# EAGLE design ESP8266-DS18B20-lite (EAGLE 7.6.0)
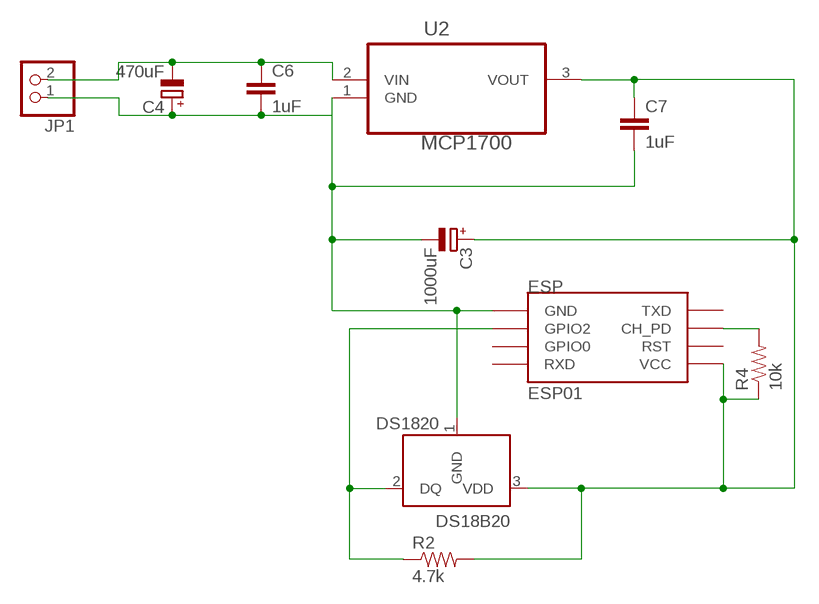
[diagram p0: schematic, sheet 1]

## Parts
C3  1000uF  CPOL-EUE2.5-5  [E2,5-5]
C4  470uF  CPOL-EUE2.5-5  [E2,5-5]
C6  1uF  CAPEZ  [CAP-PTH-SMALLEZ]
C7  1uF  CAPEZ  [CAP-PTH-SMALLEZ]
DS18B20  DS1820  [TO-92]
ESP  ESP01  [ESP01]
JP1  PINHD-1X2/90  [1X02/90]
R2  4.7k  RESISTORAXIAL-0.3  [AXIAL-0.3]
R4  10k  RESISTORAXIAL-0.3  [AXIAL-0.3]
U2  MCP1700  MCP1700-3302E/TO  [TO127P254X495-3]

## Nets
3V3: C3.+ C7.1 DS18B20.3(VDD) ESP.VCC R2.P$2 R4.P$1 U2.3(VOUT)
6.2V: C4.- C6.1 JP1.2 U2.2(VIN)
CH: ESP.CH_PD R4.P$2
DQ: DS18B20.2(DQ) ESP.GPIO2 R2.P$1
GND: C3.- C4.+ C6.2 C7.2 DS18B20.1(GND) ESP.GND JP1.1 U2.1(GND)
Unconnected: ESP.GPIO0 ESP.RST ESP.RX(RXD) ESP.TX(TXD)

## Library data of the parts
C3 C4 = rcl:CPOL-EU: POLARIZED CAPACITOR, European symbol
C6 C7 = SparkFun-Capacitors:CAP: Capacitor Standard 0603 ceramic capacitor, and 0.1" leaded capacitor.
DS18B20 = DS1820:DS1820: DS1820 - 1-Wire Digital Thermometer
ESP = esp8266modules:ESP01: ESP8266 Wifi module 01
JP1 = pinhead:PINHD-1X2: PIN HEADER
R2 R4 = SparkFun-Passives:RESISTOR: Resistor Basic schematic elements and footprints for 0603, 1206, and PTH resistors.
U2 = mcp1700:MCP1700-3302E/TO: IC, Low Quiescent Current LDO,3.3V,TO-92; MPN: MCP1700-3302E/TO; OC_FARNELL: 1296588; OC_NEWARK: 88H9804; PACKAGE: TO-92; SUPPLIER: Microchip

## Board
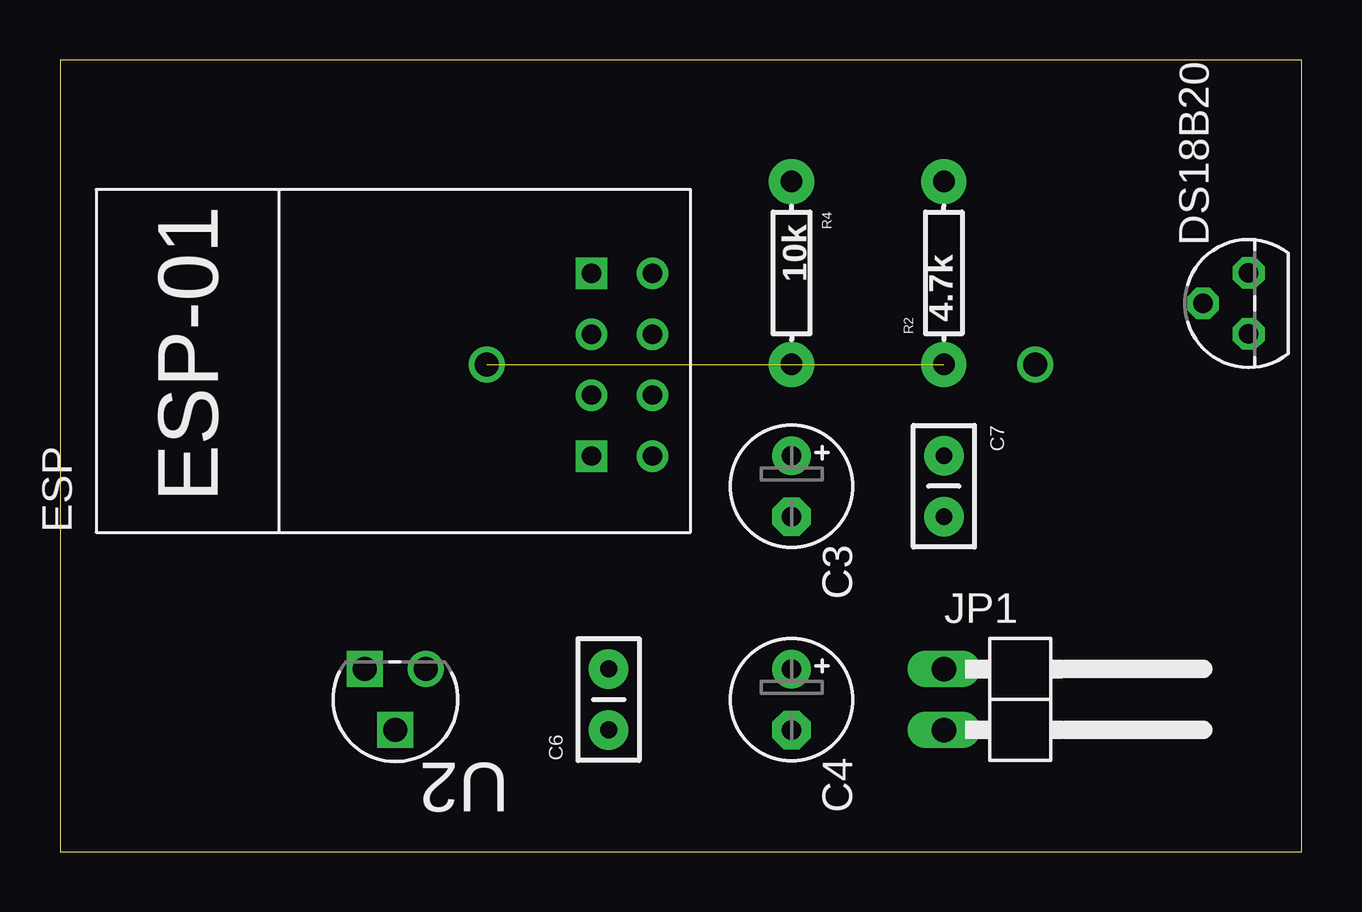
[diagram p1: board, top side]
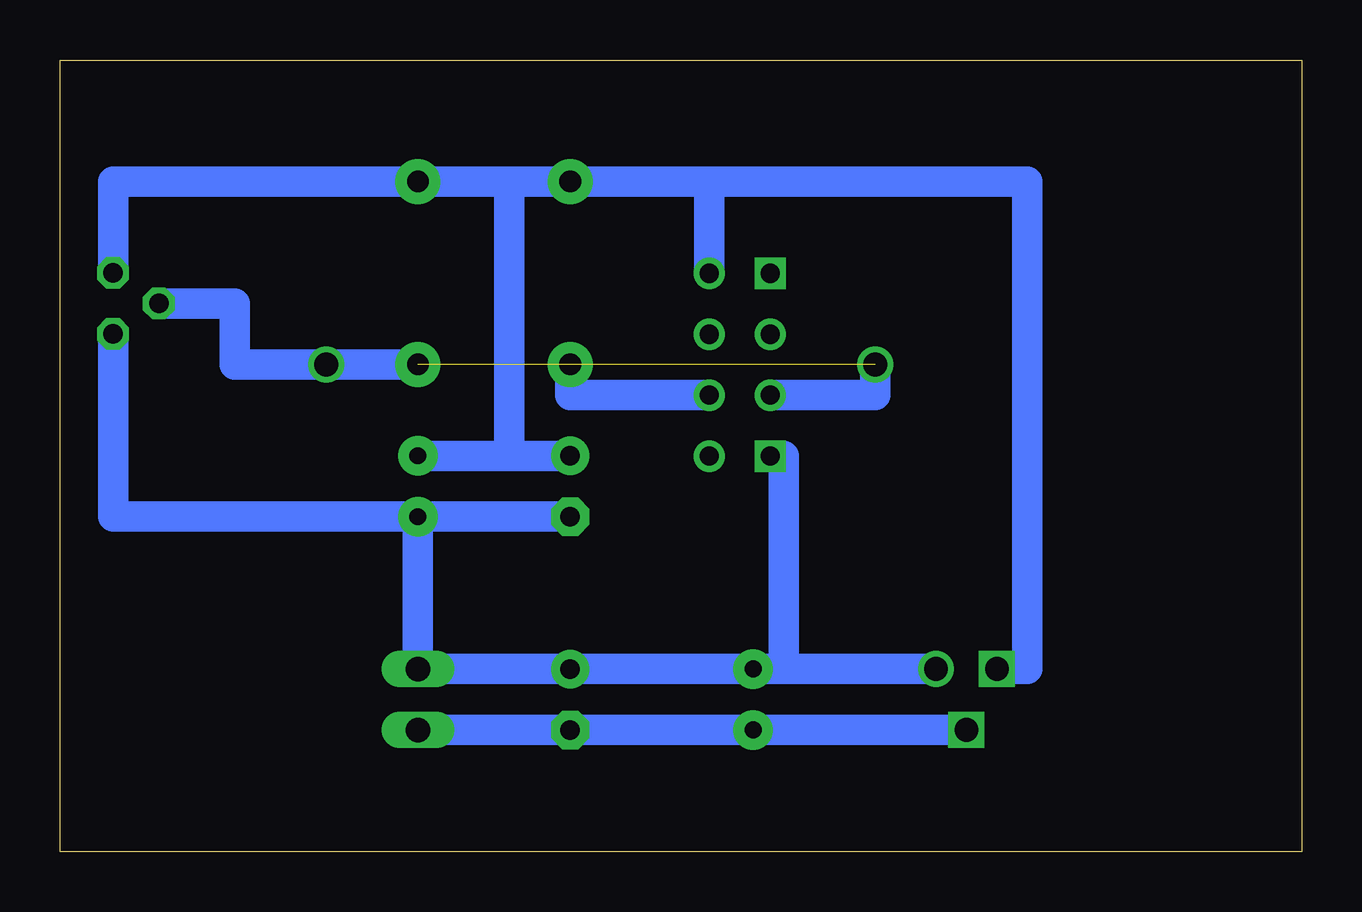
[diagram p2: board, bottom side, seen from below]

Size 51.74 x 33.01 mm. Coordinates in mm from the lower left corner, seen from the top.
Outline: 0,0 51.74,0 51.74,33.01 0,33.01 0,0
Copper layers (1*16): Top 0.035mm / dielectric 1.5mm / Bottom 0.035mm
Design rules "default": minimum track width 10mil, minimum drill 24mil, track to track 8mil, track to pad 8mil, pad to pad 8mil, via to via 8mil, smd to smd 8mil, copper to edge 40mil, drill to drill 8mil, minimum pad ring 10mil, minimum via ring 8mil, stop-mask expansion 4mil, vias tented up to drill 0mil, thermal gap 10mil

### Footprints (pad centres in the part's own frame; a part is rotated, then mirrored left to right if it is on the bottom)
E2,5-5 = drill 0.813 pad 1.6: + -1.27,0 | drill 0.813 pad 1.6 octagon: - 1.27,0
CAP-PTH-SMALLEZ = drill 0.7 pad 1.651: 1 0,0; 2 2.54,0
TO-92 = drill 0.813 pad 1.27 octagon: 1 -1.27,0; 2 0,1.905; 3 1.27,0
ESP01 = drill 0.8: CH_PD -1.285,-8.178; GPIO0 1.255,-5.638; GPIO2 -1.285,-5.638; RST 1.255,-8.178; TX -3.825,-8.178; VCC 3.795,-8.178 | drill 0.8 square: GND -3.825,-5.638; RX 3.795,-5.638
1X02/90 = drill 1.016 long: 1 -1.27,-3.81; 2 1.27,-3.81
AXIAL-0.3 = drill 0.9 pad 1.88: P$1 -3.81,0; P$2 3.81,0
TO127P254X495-3 = drill 0.991: 1 -2.54,-2.54 | drill 0.991 square: 2 -1.27,0; 3 0,-2.54

### Placement (x,y rotation side)
C3  30.48,15.24 270 top
C4  30.48,6.35 270 top
C6  22.86,5.08 90 top
C7  36.83,16.51 270 top
DS18B20  49.53,22.86 90 top
ESP  16.51,20.32 90 top
JP1  40.64,6.35 270 top
R2  36.83,24.13 90 top
R4  30.48,24.13 270 top
U2  12.7,5.08 180 top

### Tracks (layer width: path | path; a pad name or v marks a point on that pad's centre or on a via)
3V3
  Bottom 1.27: DS18B20.3 49.53,27.94 R2.P$2 33.02,27.94 | C7.1 C3.+ 33.02,16.51 33.02,27.94 | 33.02,27.94 R4.P$1 24.69,27.94 | 24.69,27.94 ESP.VCC | U2.3 11.43,7.62 11.43,27.94 24.69,27.94
6.2V
  Bottom 1.27: U2.2 C6.1 C4.- JP1.2
CH
  Bottom 1.27: R4.P$2 30.48,19.05 ESP.CH_PD
DQ  (via drill 1)  (1 unrouted)
  Bottom 1.27: DS18B20.2 44.45,22.86 44.45,20.32 v40.64,20.32 R2.P$1 | ESP.GPIO2 17.78,19.03 v17.78,20.32
GND
  Bottom 1.27: ESP.GND 21.59,16.49 21.59,7.62 C6.2 | U2.1 C6.2 | C6.2 C4.+ JP1.1 C7.2 | C7.2 C3.- | C7.2 49.53,13.97 DS18B20.1